# EAGLE design 4watt (EAGLE 6.5.0)

## Sheet 1 of 2
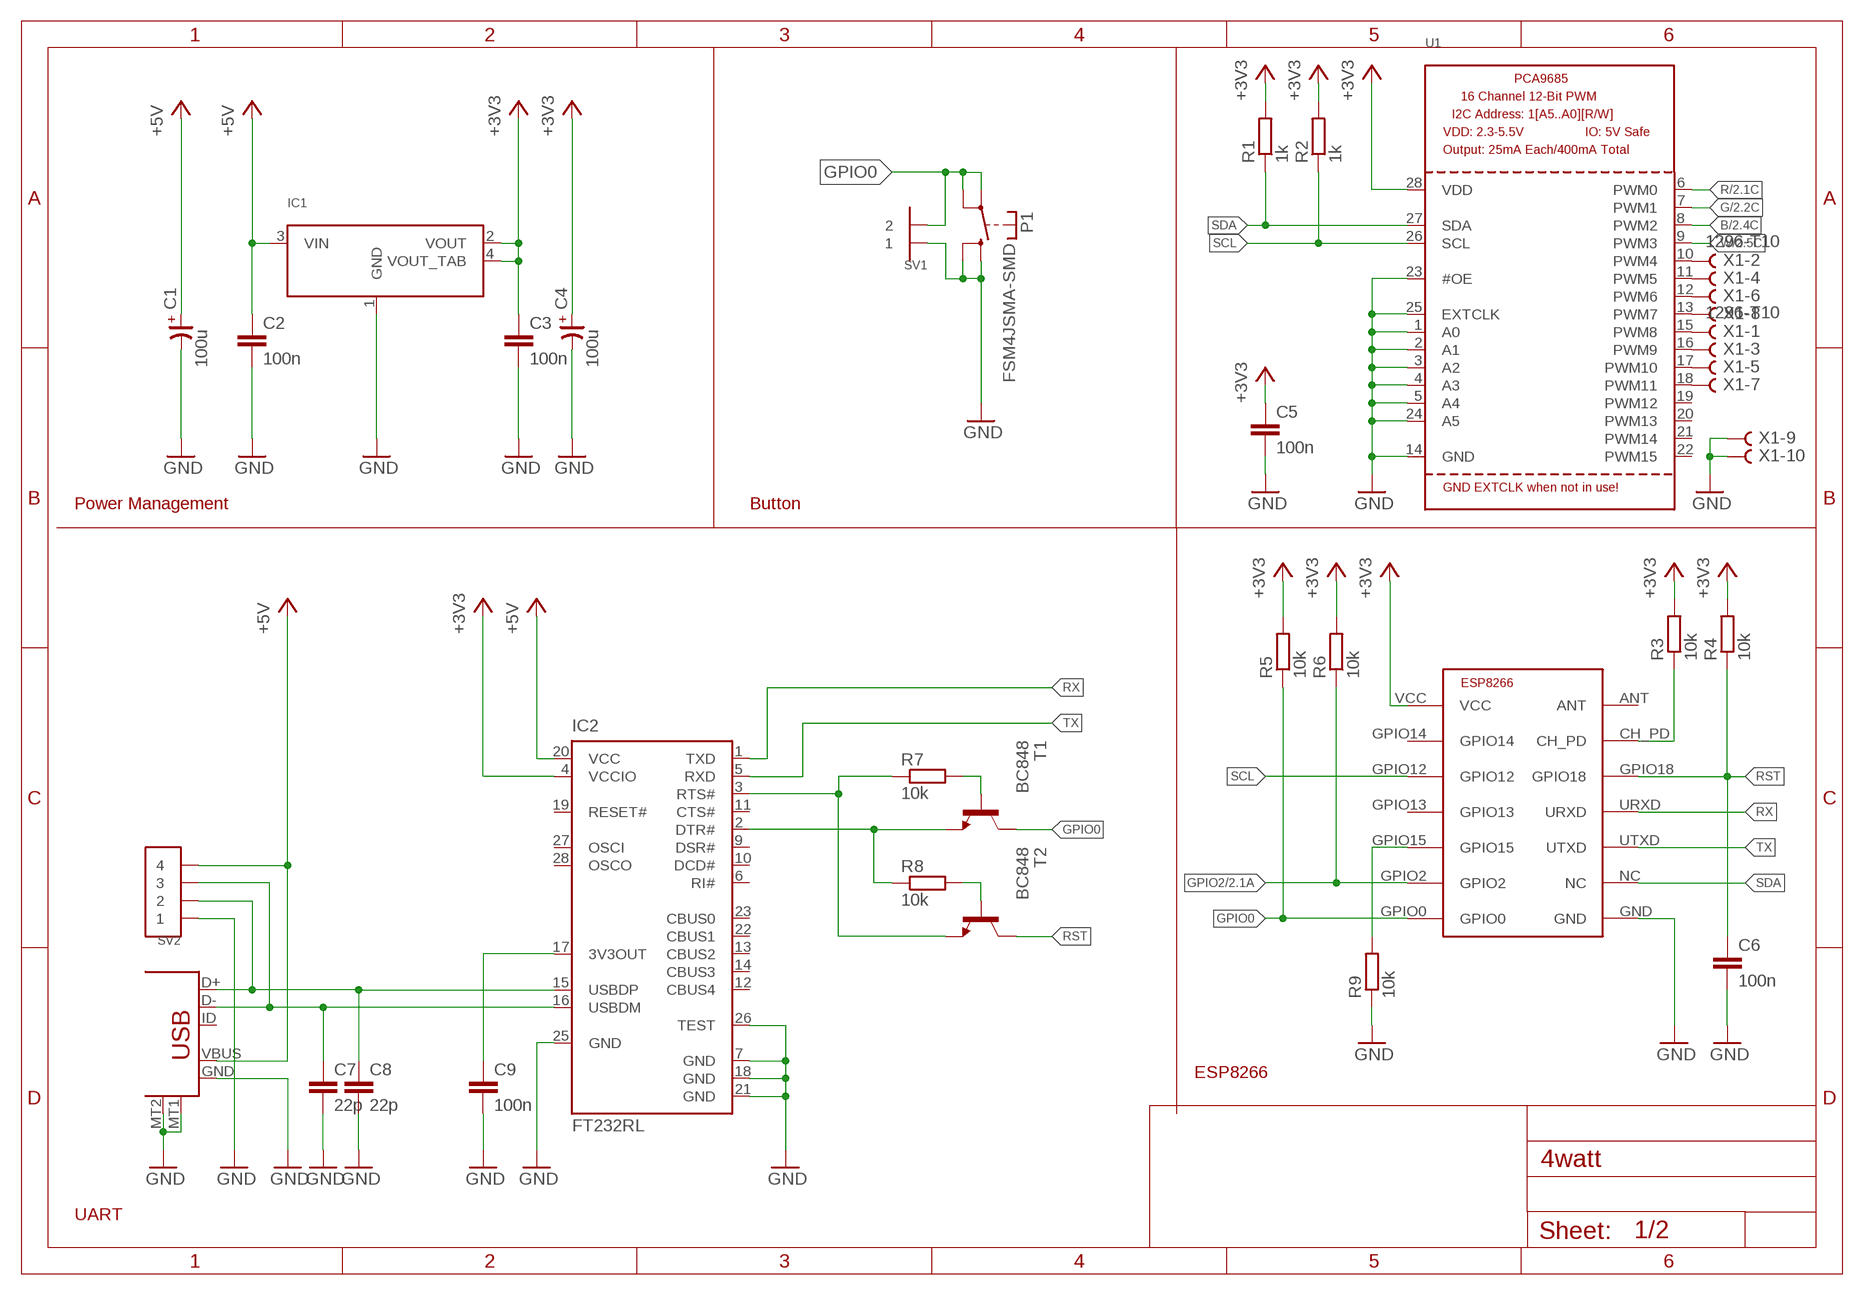
[diagram p0: schematic, sheet 1]

### Parts
C1  100u  CP-7343-TE-D  [7343-TE-D]
C2  100n  C-EUC0603  [C0603]
C3  100n  C-EUC0603  [C0603]
C4  100u  CP-7343-TE-D  [7343-TE-D]
C5  100n  C-EUC0603  [C0603]
C6  100n  C-EUC0603  [C0603]
C7  22p  C-EUC0603  [C0603]
C8  22p  C-EUC0603  [C0603]
C9  100n  C-EUC0603  [C0603]
IC1  LM1117IMP  [SOT223]
IC2  FT232RL  [SSOP28]
P1  FSM4JSMA-SMD  [FSM4JSMA-SMD]
R1  1k  R-EU_R0603  [R0603]
R2  1k  R-EU_R0603  [R0603]
R3  10k  R-EU_R0603  [R0603]
R4  10k  R-EU_R0603  [R0603]
R5  10k  R-EU_R0603  [R0603]
R6  10k  R-EU_R0603  [R0603]
R7  10k  R-EU_R0603  [R0603]
R8  10k  R-EU_R0603  [R0603]
R9  10k  R-EU_R0603  [R0603]
SV1  1X2SMD-2.54LIEGEND  [1X2SMD-2.54LIEGEND]
SV2  1X4SMD-2.54LIEGEND  [1X4SMD-2.54LIEGEND]
T1  BC848  [SOT23]
T2  BC848  [SOT23]
U1  PCA9685  [TSSOP28]
U$1  ESP8266  [ESP-03]
X1  1296-T10  [1296-10]
X2  USB-B  [USB-MICROB]

### Nets
+3V3: C3.1 C4.+ C5.1 IC1.2(VOUT) IC1.4(VOUT_TAB) IC2.4(VCCIO) R1.2 R2.2 R3.2 R4.2 R5.2 R6.2 U1.28(VDD) U$1.VCC
+5V [pwr]: C1.+ C2.1 IC1.3(VIN) IC2.20(VCC) SV2.P$4 X2.VBUS ; also sheet 2
B: U1.8(PWM2) ; also sheet 2
G: U1.7(PWM1) ; also sheet 2
GND [pwr]: C1.- C2.2 C3.2 C4.- C5.2 C6.2 C7.2 C8.2 C9.2 IC1.1(GND) IC2.7(GND) IC2.18(GND) IC2.21(GND) IC2.25(GND) IC2.26(TEST) P1.P$3(S) P1.P$4(S) R9.1 SV1.P$1 SV2.P$1 U1.1(A0) U1.2(A1) U1.3(A2) U1.4(A3) U1.5(A4) U1.14(GND) U1.23(#OE) U1.24(A5) U1.25(EXTCLK) U$1.GND X1.9 X1.10 X2.GND X2.MT1 X2.MT2 ; also sheet 2
GPIO0: P1.P$1(P) P1.P$2(P) R5.1 SV1.P$2 T1.3(C) U$1.GPIO0
GPIO2: R6.1 U$1.GPIO2 ; also sheet 2
GPIO15: R9.2 U$1.GPIO15
N$1: IC2.3(RTS#) R7.1 T2.2(E)
N$2: R3.1 U$1.CH_PD
N$3: C8.1 IC2.15(USBDP) SV2.P$2 X2.D+
N$4: C7.1 IC2.16(USBDM) SV2.P$3 X2.D-
N$5: IC2.2(DTR#) R8.1 T1.2(E)
N$7: R7.2 T1.1(B)
N$8: R8.2 T2.1(B)
N$12: C9.1 IC2.17(3V3OUT)
N$15: U1.10(PWM4) X1.2
N$16: U1.11(PWM5) X1.4
N$17: U1.12(PWM6) X1.6
N$18: U1.13(PWM7) X1.8
N$19: U1.15(PWM8) X1.1
N$20: U1.16(PWM9) X1.3
N$21: U1.17(PWM10) X1.5
N$22: U1.18(PWM11) X1.7
R: U1.6(PWM0) ; also sheet 2
RST: C6.1 R4.1 T2.3(C) U$1.GPIO18
RX: IC2.1(TXD) U$1.URXD
SCL: R2.1 U1.26(SCL) U$1.GPIO12
SDA: R1.1 U1.27(SDA) U$1.NC
TX: IC2.5(RXD) U$1.UTXD
W: U1.9(PWM3) ; also sheet 2
Unconnected: IC2.6(RI#) IC2.9(DSR#) IC2.10(DCD#) IC2.11(CTS#) IC2.12(CBUS4) IC2.13(CBUS2) IC2.14(CBUS3) IC2.19(RESET#) IC2.22(CBUS1) IC2.23(CBUS0) IC2.27(OSCI) IC2.28(OSCO) U1.19(PWM12) U1.20(PWM13) U1.21(PWM14) U1.22(PWM15) U$1.ANT U$1.GPIO13 U$1.GPIO14 X2.ID

### Notes on the sheet
- Power Management | Button
- ESP8266
- UART

## Sheet 2 of 2
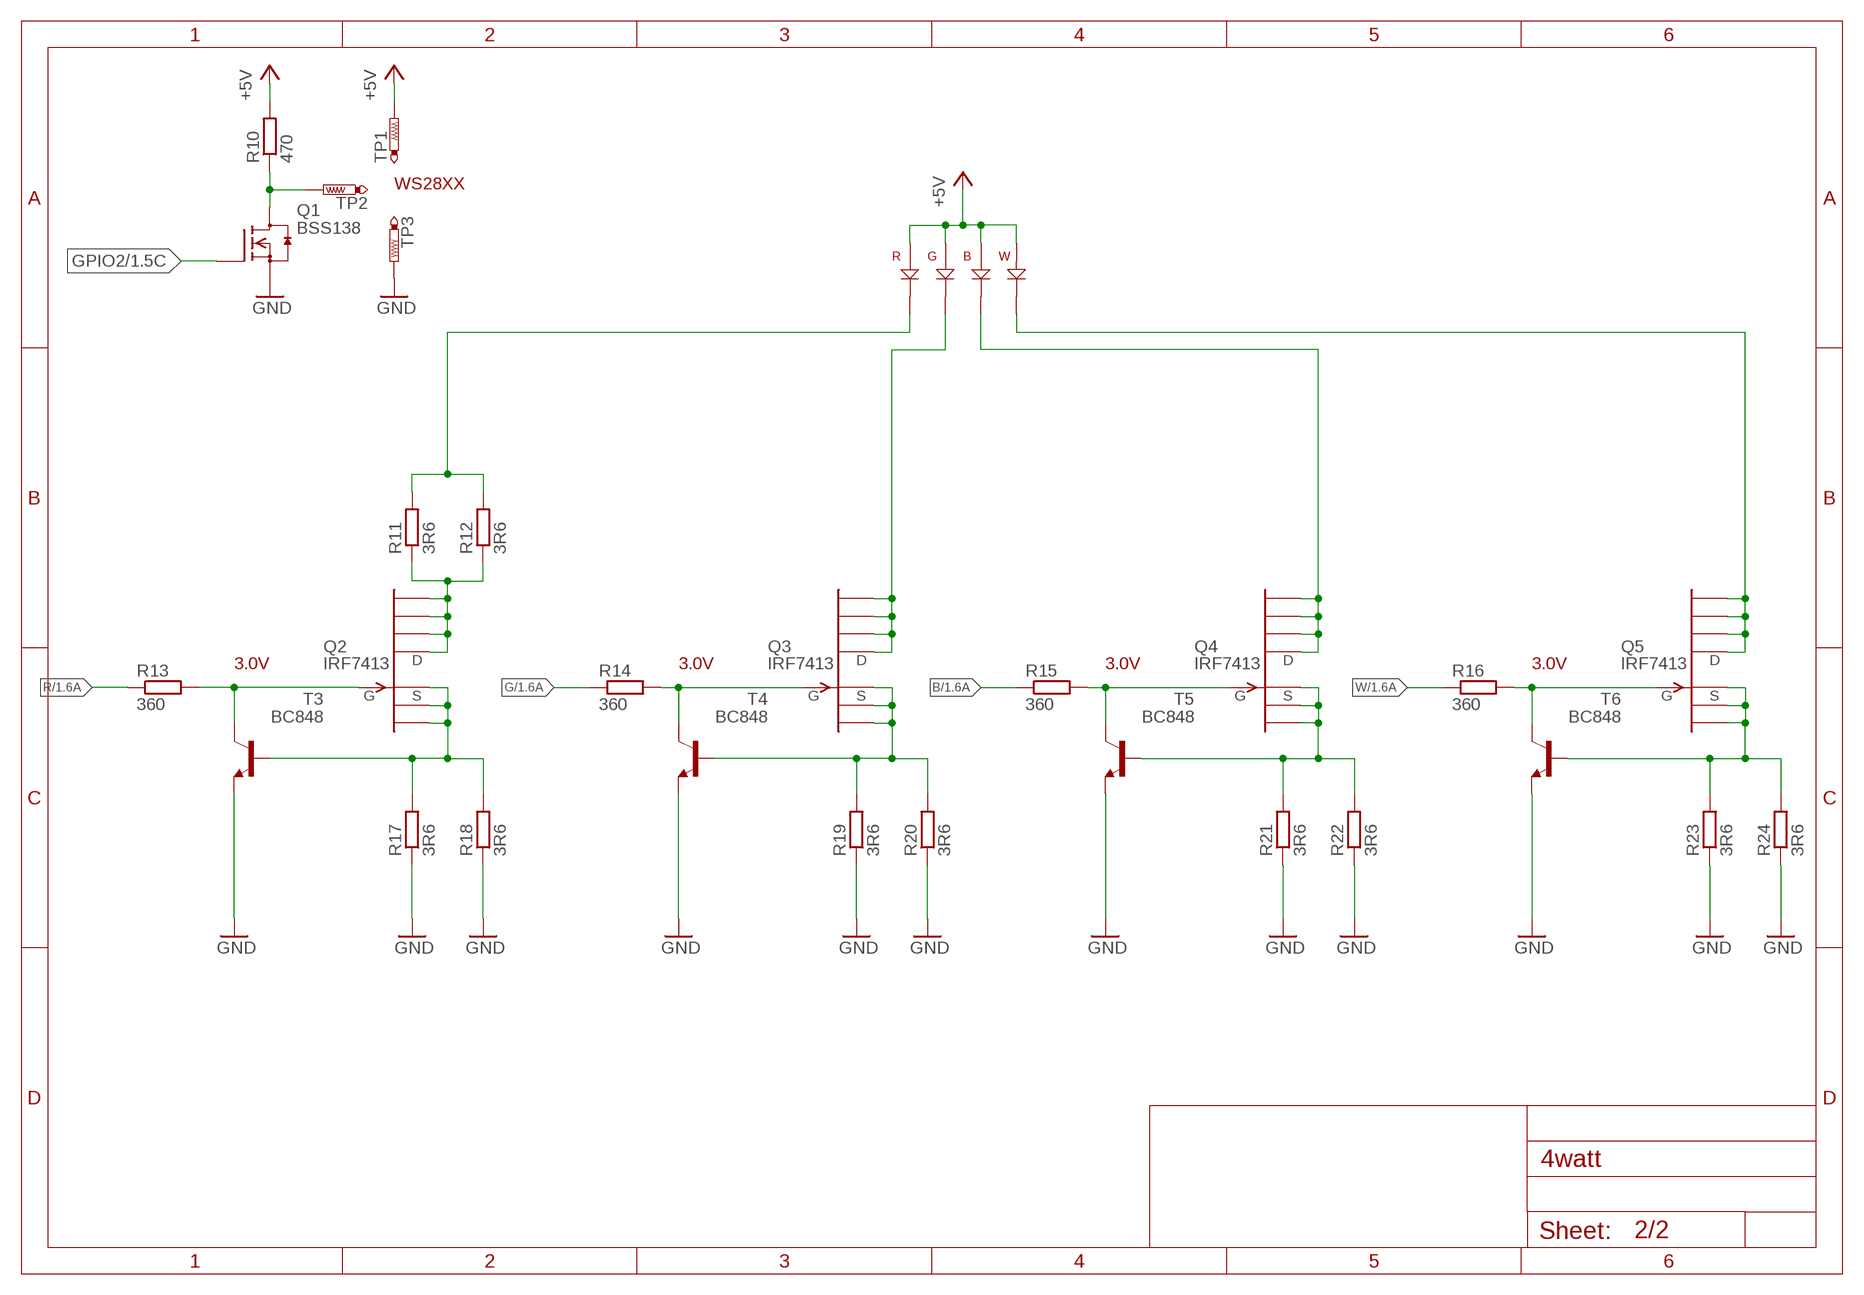
[diagram p1: schematic, sheet 2]

### Parts
LED1  JH-4RGBW14G30-E2A  [JH-4RGBW14G30-E2A]
Q1  BSS138  [SOT23]
Q2  IRF7413  [SO-8]
Q3  IRF7413  [SO-8]
Q4  IRF7413  [SO-8]
Q5  IRF7413  [SO-8]
R10  470  R-EU_R0603  [R0603]
R11  3R6  R-EU_M1206  [M1206]
R12  3R6  R-EU_M1206  [M1206]
R13  360  R-EU_R0603  [R0603]
R14  360  R-EU_R0603  [R0603]
R15  360  R-EU_R0603  [R0603]
R16  360  R-EU_R0603  [R0603]
R17  3R6  R-EU_M1206  [M1206]
R18  3R6  R-EU_M1206  [M1206]
R19  3R6  R-EU_M1206  [M1206]
R20  3R6  R-EU_M1206  [M1206]
R21  3R6  R-EU_M1206  [M1206]
R22  3R6  R-EU_M1206  [M1206]
R23  3R6  R-EU_M1206  [M1206]
R24  3R6  R-EU_M1206  [M1206]
T3  BC848  [SOT23]
T4  BC848  [SOT23]
T5  BC848  [SOT23]
T6  BC848  [SOT23]
TP1  PTR1B2,54  [B2,54]
TP2  PTR1B1,27  [B1,27]
TP3  PTR1B2,54  [B2,54]

### Nets
+5V [pwr]: LED1.B+ LED1.G+ LED1.R+ LED1.W+ R10.2 TP1.TP ; also sheet 1
B: R15.1 ; also sheet 1
G: R14.1 ; also sheet 1
GND [pwr]: Q1.2(S) R17.1 R18.1 R19.1 R20.1 R21.1 R22.1 R23.1 R24.1 T3.2(E) T4.2(E) T5.2(E) T6.2(E) TP3.TP ; also sheet 1
GPIO2: Q1.1(G) ; also sheet 1
N$6: Q1.3(D) R10.1 TP2.TP
N$9: Q2.1(S) Q2.2(S1) Q2.3(S2) R17.2 R18.2 T3.1(B)
N$10: Q2.5(D) Q2.6(D1) Q2.7(D2) Q2.8(D3) R11.1 R12.1
N$11: Q5.4(G) R16.2 T6.3(C)
N$13: Q5.1(S) Q5.2(S1) Q5.3(S2) R23.2 R24.2 T6.1(B)
N$14: LED1.W- Q5.5(D) Q5.6(D1) Q5.7(D2) Q5.8(D3)
N$24: Q2.4(G) R13.2 T3.3(C)
N$25: LED1.R- R11.2 R12.2
N$26: Q3.4(G) R14.2 T4.3(C)
N$27: Q3.1(S) Q3.2(S1) Q3.3(S2) R19.2 R20.2 T4.1(B)
N$28: LED1.G- Q3.5(D) Q3.6(D1) Q3.7(D2) Q3.8(D3)
N$29: Q4.4(G) R15.2 T5.3(C)
N$30: Q4.1(S) Q4.2(S1) Q4.3(S2) R21.2 R22.2 T5.1(B)
N$31: LED1.B- Q4.5(D) Q4.6(D1) Q4.7(D2) Q4.8(D3)
R: R13.1 ; also sheet 1
W: R16.1 ; also sheet 1

### Notes on the sheet
- WS28XX
- 3.0V | 3.0V | 3.0V | 3.0V

## Library data of the parts
C1 C4 = cap-master:CP-: POLARIZED CAP
C2 C3 C5-C9 = rcl:C-EU: CAPACITOR, European symbol
IC1 = sid:LM1117IMP
IC2 = ftdichip:FT232R: Source: http://www.ftdichip.com/Documents/DataSheets/DS_FT232R_v104.pdf
LED1 = sid:JH-4RGBW14G30-E2A
P1 = switch-misc:FSM4JSMA-SMD: TYCO SWITCH
Q1 = m-pad-2.1:BSS138: Fairchild Semiconductors BSS138 N-Channel Logic Level Enhancement Mode Field Effect Transistor General Description: These N-Channel enhancement mode field effect transistors are produced using Fairchild's proprietary, high cell density, DMOS technology. These products have been designed to minimize on-state resistance while provide rugged, reliable, and fast switching performance.These products are particularly suited for low voltage, low current applications such as small servo motor control, power MOSFET gate drivers, and other switching applications. Features: 0.22 A, 50 V. RDS(ON) = 3.5Ohm @ VGS = 10 V RDS(ON) = 6.0Ohm @ VGS = 4.5 V High density cell design for extremely low RDS(ON) Rugged and Reliable Compact industry standard SOT-23 surface mount package Please send any comments to: messi@users.sourceforge.net
Q2-Q5 = transistor-fet:IRF7413
R1-R24 = rcl-2:R-EU_: RESISTOR, European symbol
SV1 = sid:1X2SMD-2.54LIEGEND
SV2 = sid:1X4SMD-2.54LIEGEND
T1 T2 = transistor-neu-to92:BC848: NPN TRANSISTOR
T3-T6 = transistor:BC848: NPN TRANSISTOR
TP1-TP3 = testpad:PTR1: TEST PIN
U1 = adafruit:PCA9685: PCA9685 - 16 Channel 12-Bit I2C PWM Controller 5.0V tolerant 16 channel, 12-bit I2C PWM controller with 25mA per output (max. 400mA total) Digikey: 568-5931-1-ND
U$1 = ESP8266:ESP8266: low cost Wifi to Serial Module
X1 = con-leotronics:1296-T10: 1.27mm SINGLE ROW FEMALE SOCKET Source: http://www.leotronics.co.uk/Conexcon/Data%20Sheets/sec.%20A/1296ing.pdf
X2 = sid:USB-B

## Net classes
0 default: width 0.152 mm, drill 0.305 mm, clearance 0.152 mm
1 pwr: width 0.152 mm, drill 0.305 mm, clearance 0.152 mm

## Board
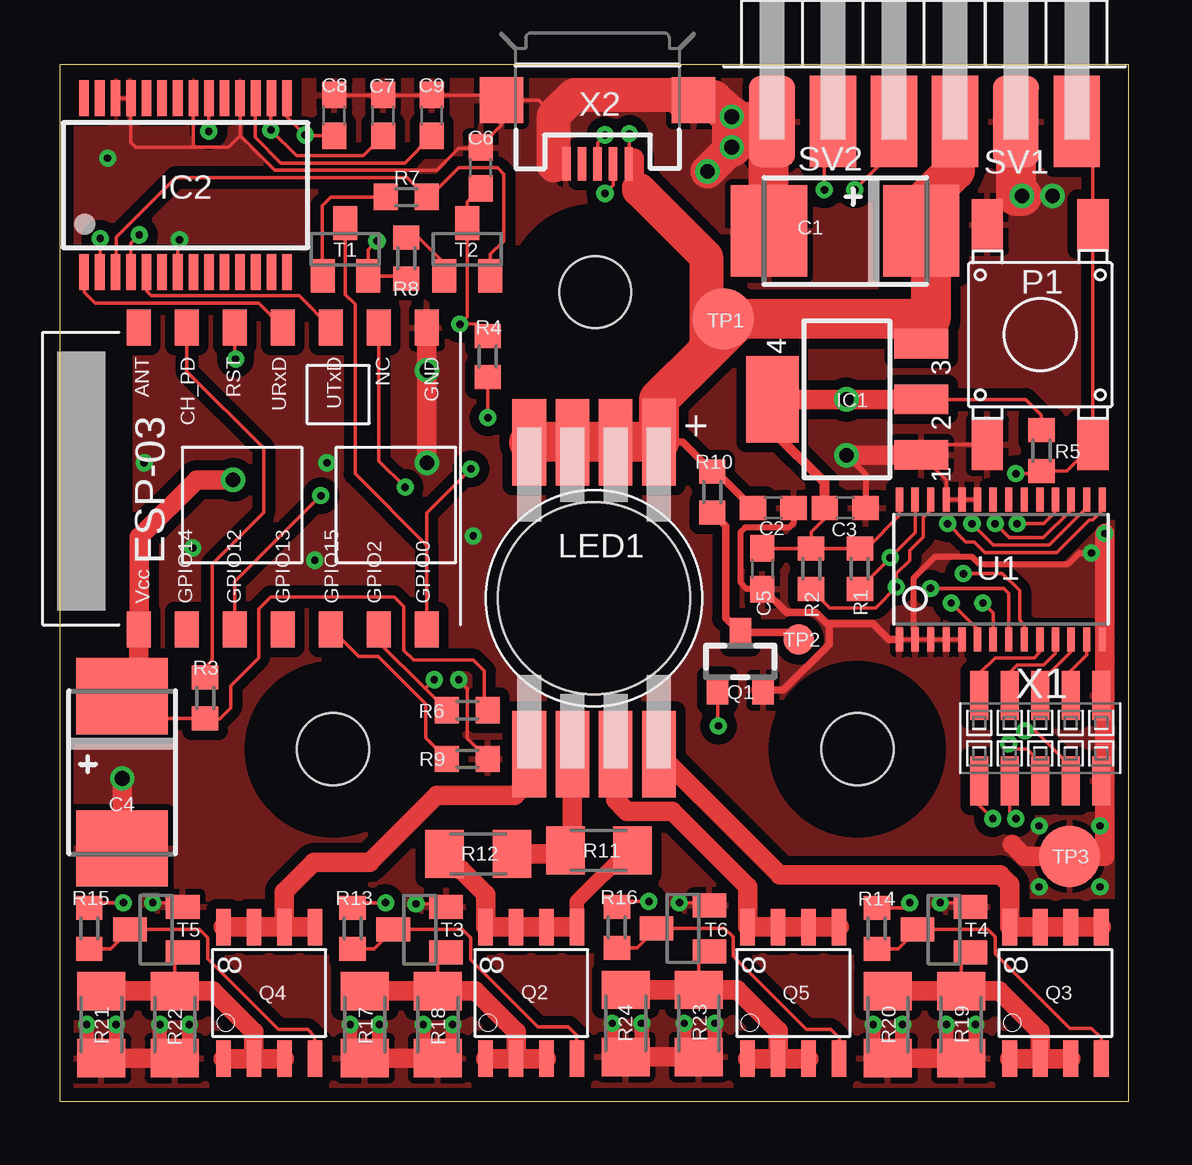
[diagram p2: board, top side]
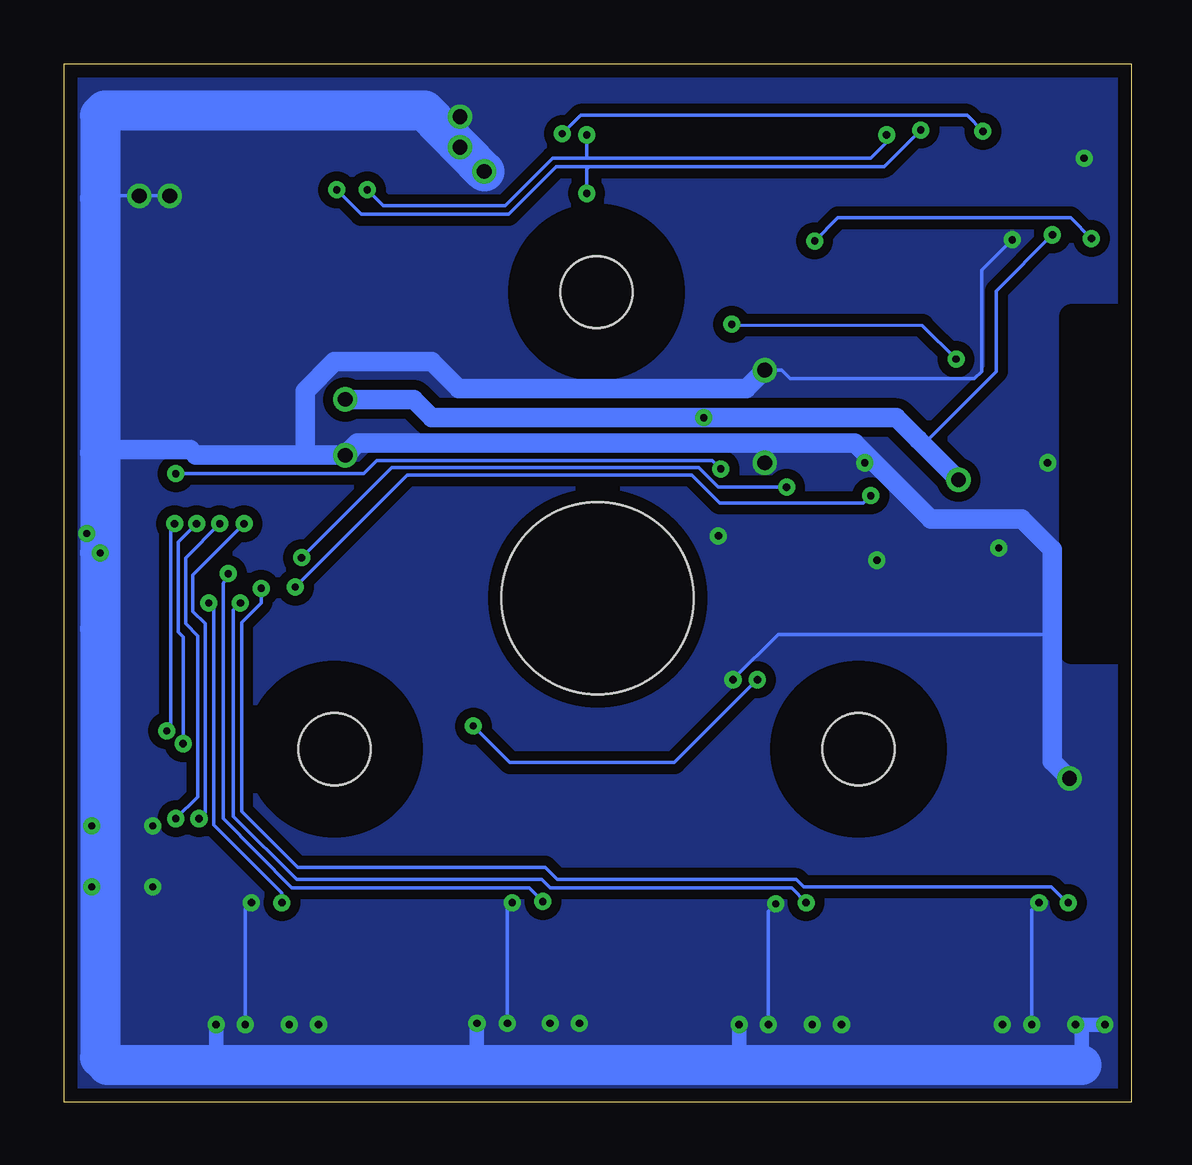
[diagram p3: board, bottom side, seen from below]

Size 44.5 x 43.24 mm. Coordinates in mm from the lower left corner, seen from the top.
Outline: 44.5,43.24 44.5,0 0,0 0,43.24 44.5,43.24
Copper layers (1*16): Top 0.035mm / dielectric 1.5mm / Bottom 0.035mm
Design rules "default *": minimum track width 6mil, minimum drill 12mil, track to track 6mil, track to pad 6mil, pad to pad 6mil, via to via 6mil, smd to smd 6mil, copper to edge 22mil, drill to drill 8mil, minimum pad ring 10mil, minimum via ring 8mil, stop-mask expansion 4mil, vias tented up to drill 26mil, thermal gap 10mil
Holes 3 mm at 22.3,33.74 11.38,14.69 33.22,14.69
tRestrict: area 19.1,30.5 to 25.5,36.9; area 8.2,11.5 to 14.6,17.9; area 30,11.5 to 36.4,17.9; 3 lines
bRestrict: area 30,11.5 to 36.4,17.9; area 8.2,11.5 to 14.6,17.9; area 19.1,30.5 to 25.5,36.9; 3 lines

### Footprints (pad centres in the part's own frame; a part is rotated, then mirrored left to right if it is on the bottom)
7343-TE-D = smd 3.175 x 3.81: + 3.175,0; - -3.175,0
C0603 = smd 1.1 x 1: 1 -0.85,0; 2 0.85,0
SOT223 = smd 1.219 x 2.235: 1 -2.311,-3.099; 2 0,-3.099; 3 2.311,-3.099 | smd 3.6 x 2.2: 4 0,3.099
SSOP28 = smd 0.4 x 1.5: 1 -4.225,-3.625; 2 -3.575,-3.625; 3 -2.925,-3.625; 4 -2.275,-3.625; 5 -1.625,-3.625; 6 -0.975,-3.625; 7 -0.325,-3.625; 8 0.325,-3.625; 9 0.975,-3.625; 10 1.625,-3.625; 11 2.275,-3.625; 12 2.925,-3.625; 13 3.575,-3.625; 14 4.225,-3.625; 15 4.225,3.625; 16 3.575,3.625; 17 2.925,3.625; 18 2.275,3.625; 19 1.625,3.625; 20 0.975,3.625; 21 0.325,3.625; 22 -0.325,3.625; 23 -0.975,3.625; 24 -1.625,3.625; 25 -2.275,3.625; 26 -2.925,3.625; 27 -3.575,3.625; 28 -4.225,3.625
JH-4RGBW14G30-E2A = smd 3.6 x 1.4: B+ -6.5,-2.7; B- 6.5,-2.7; G+ -6.5,2.7; G- 6.5,2.7; R+ -6.5,-0.9; R- 6.5,-0.9; W+ -6.5,0.9; W- 6.5,0.9 | hole 8: 0,0
FSM4JSMA-SMD = smd 1.3 x 2.1: P$1 -2.196,4.584; P$2 -2.196,-4.6; P$3 2.204,4.584; P$4 2.204,-4.6
SOT23 = smd 0.9 x 1.2: 1 -0.95,-1.2; 2 0.95,-1.2; 3 0,1.2
SO-8 = smd 1.524 x 0.61: 1 -2.743,1.27; 2 -2.743,0; 3 -2.743,-1.27; 4 -2.743,-2.54; 5 2.743,-2.54; 6 2.743,-1.27; 7 2.743,0; 8 2.743,1.27
R0603 = smd 1 x 1.1: 1 -0.85,0; 2 0.85,0
M1206 = smd 1.6 x 2: 1 -1.4,0; 2 1.4,0
1X2SMD-2.54LIEGEND = smd 1.93 x 3.81: P$1 -1.27,-0.254; P$2 1.27,-0.254
1X4SMD-2.54LIEGEND = smd 1.93 x 3.81: P$1 -5.08,0; P$2 -2.54,0; P$3 0,0; P$4 2.54,0
SOT23' = smd 1 x 1.4: 1 -0.95,-1.1; 2 0.95,-1.1; 3 0,1.1
B2,54 = smd 2.54 x 2.54: TP 0,0
B1,27 = smd 1.27 x 1.27: TP 0,0
TSSOP28 = smd 0.305 x 0.991: 1 -4.225,-2.918; 2 -3.575,-2.918; 3 -2.925,-2.918; 4 -2.275,-2.918; 5 -1.625,-2.918; 6 -0.975,-2.918; 7 -0.325,-2.918; 8 0.325,-2.918; 9 0.975,-2.918; 10 1.625,-2.918; 11 2.275,-2.918; 12 2.925,-2.918; 13 3.575,-2.918; 14 4.225,-2.918; 15 4.225,2.918; 16 3.575,2.918; 17 2.925,2.918; 18 2.275,2.918; 19 1.625,2.918; 20 0.975,2.918; 21 0.325,2.918; 22 -0.325,2.918; 23 -0.975,2.918; 24 -1.625,2.918; 25 -2.275,2.918; 26 -2.925,2.918; 27 -3.575,2.918; 28 -4.225,2.918
ESP-03 = smd 1 x 1.5: ANT 4,12.4; CH_PD 6,12.4; GND 16,12.4; GPIO0 16,-0.2; GPIO2 14,-0.2; GPIO12 8,-0.2; GPIO13 10,-0.2; GPIO14 6,-0.2; GPIO15 12,-0.2; GPIO18 8,12.4; NC 14,12.4; URXD 10,12.4; UTXD 12,12.4; VCC 4,-0.2
1296-10 = smd 0.76 x 2.05: 1 -2.54,-1.78; 2 -2.54,1.78; 3 -1.27,-1.78; 4 -1.27,1.78; 5 0,-1.78; 6 0,1.78; 7 1.27,-1.78; 8 1.27,1.78; 9 2.54,-1.78; 10 2.54,1.78
USB-MICROB = smd 0.35 x 1.4: D+ 0,2.65; D- -0.65,2.65; GND 1.3,2.65; ID 0.65,2.65; VBUS -1.3,2.65 | smd 1.8 x 1.9: MT1 -4,0; MT2 4,0

### Placement (x,y rotation side)
C1  32.72,36.29 0 top
C2  29.72,24.75 0 top
C3  32.72,24.75 0 top
C4  2.59,13.72 90 top
C5  29.26,22.21 270 top
C6  17.53,38.92 90 top
C7  13.46,41.11 90 top
C8  11.43,41.11 90 top
C9  15.49,41.11 90 top
IC1  32.79,29.27 90 top
IC2  5.23,38.2 0 top
LED1  22.25,20.99 270 top
P1  40.84,31.96 180 top
Q1  28.35,18.35 0 top
Q2  19,4.53 90 top
Q3  40.84,4.53 90 top
Q4  8.08,4.53 90 top
Q5  29.92,4.53 90 top
R1  33.33,22.21 90 top
R2  31.29,22.21 90 top
R3  6.05,16.82 270 top
R4  17.82,31.05 270 top
R5  40.89,27.14 90 top
R6  16.97,16.32 0 top
R7  14.43,37.7 180 top
R8  14.43,35.16 90 top
R9  16.97,14.28 180 top
R10  27.18,25.41 90 top
R11  22.45,10.47 180 top
R12  17.43,10.32 0 top
R13  12.19,7.22 270 top
R14  34.04,7.22 270 top
R15  1.22,7.22 270 top
R16  23.2,7.26 270 top
R17  12.7,3.21 90 top
R18  15.75,3.21 90 top
R19  37.54,3.21 90 top
R20  34.49,3.21 90 top
R21  1.73,3.21 90 top
R22  4.78,3.21 90 top
R23  26.62,3.26 90 top
R24  23.57,3.26 90 top
SV1  41.1,41.11 0 top
SV2  34.75,40.85 0 top
T1  BC848  [SOT23']  11.89,35.52 0 top
T2  BC848  [SOT23']  16.97,35.52 0 top
T3  BC848  [SOT23']  14.99,7.17 90 top
T4  BC848  [SOT23']  36.83,7.17 90 top
T5  BC848  [SOT23']  4.01,7.17 90 top
T6  BC848  [SOT23']  25.96,7.22 90 top
TP1  27.64,32.62 0 top
TP2  30.79,19.26 0 top
TP3  42.06,10.22 0 top
U1  39.2,22.18 0 top
U$1  -0.71,19.87 0 top
X1  40.84,15.15 0 top
X2  22.4,41.74 180 top

### Tracks (layer width: path | path; a pad name or v marks a point on that pad's centre or on a via)
+3V3  (via drill 0.3, 0.61)
  Top 0.152: IC2.4 2.96,35.78 v3.3,36.13 | U1.28 34.98,24.42 33.68,23.12 33.44,23.11 R1.2 R2.2 | R2.2 C5.1 | C3.1 31.85,24.29 31.29,23.73 R2.2 | IC1.2 40.23,29.27 40.9,28.61 R5.2 | 3.29,17.6 3.29,15.97 R3.2 6.06,15.96 6.66,15.96 7.11,16.42 7.11,17.33 8.28,18.5 8.28,20.53 8.79,21.04 13.92,21.04 14.33,20.63 14.33,18.8 14.73,18.4 17.22,18.4 17.68,17.94 17.68,16.45 R6.2 | 18.04,29.79 R4.2 17.83,29.79 v17.83,28.51
  Top 0.406: IC1.4 29.69,27.98 31.85,25.81 31.85,24.71 C3.1
  Top 0.813: IC1.2 v32.77,29.27 IC1.4 | v7.21,25.92 5.69,25.92 3.3,23.53 3.3,19.74 U$1.VCC 3.29,17.6 C4.+
  Bottom 0.152: v3.3,36.13 5.64,33.79 5.64,30.44 8.48,27.59 8.89,27.59
  Bottom 0.813: v7.21,25.92 8.89,27.59 9.8,28.51 v17.83,28.51 29.16,28.51 29.92,29.27 v32.77,29.27
+5V  (via drill 0.3)
  Top 0.152: IC2.20 v6.21,40.45 v6.2,40.45 | v23.72,40.34 23.72,39.12 X2.VBUS
  Top 0.254: X2.VBUS 23.7,38.31 23.93,39.33
  Top 0.305: LED1.G+ 25.95,27.49 R10.2 27.41,26.21 C2.1
  Top 0.406: 26.92,31.25 26.92,30.59 TP1.TP
  Top 0.813: 23.93,39.33 23.93,38.11
  Top 1.016: 36.27,32.62 35.88,32.24 IC1.3 | 23.93,38.11 24.13,38.01
  Top 1.422: C1.+ 36.01,36.18 36.27,36.18 | 24.13,38.01 26.92,35.21 26.92,31.25
  Top 1.676: 36.27,36.18 36.27,32.62 28.3,32.62 26.92,31.25 24.95,29.28 LED1.G+ LED1.W+ LED1.R+ LED1.B+ | SV2.P$4 37.29,38.82 35.89,37.42 C1.+
  Bottom 0.152: v23.72,40.34 22.96,41.11 6.86,41.11 v6.2,40.45
B  (via drill 0.3)
  Top 0.152: R15.1 1.44,8.29 v2.64,8.29 | v36.27,21.4 39.32,21.4 39.53,21.19 U1.8
  Bottom 0.152: v2.64,8.29 2.69,8.29 3.35,8.95 13.67,8.95 13.97,9.25 23.93,9.25 24.44,9.76 34.75,9.76 37.09,12.1 37.09,19.97 36.27,20.79 v36.27,21.4
G  (via drill 0.3)
  Top 0.152: R14.1 35.19,8.07 v35.41,8.29 | v38.46,20.79 38.88,20.36 U1.7
  Bottom 0.152: v35.41,8.29 35.41,8.7 38.25,11.54 38.25,20.58 v38.46,20.79
GND  (via drill 0.3, 0.61)
  Top 0.152: T5.2 4.95,8.29 v3.86,8.29 | T3.2 15.97,8.24 v14.83,8.24 | T6.2 26.94,8.29 v25.81,8.29 | T4.2 37.76,8.29 v36.68,8.29 | C8.2 C7.2 C9.2 18.18,41.96 X2.MT2 | X2.MT2 19.94,41.74 20.58,41.11 | IC2.18 7.51,40.26 | 7.51,40.26 8.94,38.82 15.7,38.82 16.61,39.73 17.49,39.73 C6.2 17.53,39.84 18.39,40.7 X2.MT2 | IC2.26 IC2.25 2.96,39.98 3.15,39.78 5.49,39.78 | 5.49,39.78 7.04,39.78 7.51,40.26 | IC2.21 5.56,39.85 5.49,39.78 | IC2.7 4.91,35.85 v4.98,35.92 | U1.23 U1.24 U1.25 36.93,25.92 IC1.1 36.3,27.38 P1.P$3 | U1.1 U1.2 | U1.2 U1.3 U1.4 U1.5 | 29.26,21.4 C5.2 28.94,21.41 | 39.83,37.76 P1.P$4 | R9.1 16.97,15.13 16.97,17.23 v16.61,17.59 | v42.98,22.87 43.03,22.87 43.23,22.87 43.44,22.67 43.44,19.37 U1.14 | 35.56,19.67 U1.2
  Top 0.254: X2.GND 21.08,39.07 20.58,39.02 | v32.77,26.93 33.57,26.13 C3.2 | C2.2 30.57,24.12 30.38,23.94 28.55,23.94 28.35,23.73 28.35,21.65 28.6,21.4 29.22,21.4 C5.2 | 35.56,19.67 35.56,21.8 36.48,22.72 38,22.72 38.3,22.41 42.01,22.41 42.47,22.87 43.03,22.87
  Top 0.305: 29.26,21.4 30.28,20.38 31.5,20.38 31.95,19.92 32.06,19.92 | 32.06,19.92 33.87,19.92 33.94,19.87 34.54,19.27 U1.1 | Q1.2 30.14,17.15 32.06,19.06 32.06,19.92
  Top 0.61: v2.34,3.21 2.34,1.81 R21.1 1.12,1.81 v1.12,3.21 | v4.17,3.21 4.17,1.81 R22.1 5.39,1.81 v5.39,3.21 | v13.31,3.21 13.31,1.81 R17.1 12.09,1.81 v12.09,3.21 | v15.14,3.21 15.14,1.81 R18.1 16.36,1.81 v16.36,3.21 | v23.01,3.26 23.01,1.86 R24.1 24.23,1.86 v24.23,3.26 | v26.01,3.26 26.01,1.86 26.11,1.86 | v27.28,3.26 27.28,1.86 R23.1 | v33.88,3.21 33.88,1.81 R20.1 35.1,1.81 v35.1,3.21 | v36.93,3.21 36.93,1.81 R19.1 38.15,1.81 v38.15,3.21
  Top 0.813: R21.1 R22.1 | R17.1 R18.1 | R24.1 26.11,1.86 R23.1 | R20.1 R19.1 | C4.- v2.59,13.47 | v32.77,26.93 32.79,26.96 IC1.1 | U$1.GND v15.29,30.49 v15.29,26.63 | v43.54,23.68 43.54,10.22 40.18,10.22 39.68,10.73
  Top 1.422: v27.99,39.78 v26.98,38.77 | 20.58,39.02 20.58,41.11 21.44,41.97 25.66,41.97 25.88,41.74 X2.MT1
  Top 1.676: v27.99,41.05 v27.99,39.78 | v27.99,41.05 28.08,40.87 SV2.P$1 29.54,40.74 C1.- | X2.MT1 27.2,41.74 v27.99,41.05 | SV1.P$1 39.83,37.76 v40.08,37.75
  Bottom 0.152: v3.86,8.29 4.17,7.98 v4.17,3.21 | v14.83,8.24 15.14,7.93 v15.14,3.21 | v25.81,8.29 26.01,8.09 v26.01,3.26 | v36.68,8.29 36.93,8.04 v36.93,3.21 | 42.62,20.08 42.98,19.72 | v40.08,37.75 v41.35,37.75 42.88,37.75 42.98,37.65 | v15.29,30.49 14.58,30.49 14.23,30.13 6.55,30.13 6.25,30.44 6.25,34.65 v4.98,35.92 | v16.61,17.59 14.73,19.46 3.3,19.46
  Bottom 0.61: 2.08,1.53 2.08,3.21 v1.12,3.21 | v27.28,3.26 27.28,1.53 27.23,1.53 | 42.67,1.53 38.15,1.53 v38.15,3.21 | v16.36,3.21 16.36,1.53 17.27,1.53
  Bottom 0.813: v2.59,13.47 3.3,14.18 3.3,19.46 3.3,23.02 4.57,24.29 8.38,24.29 11.53,27.44 32.26,27.44 v32.77,26.93 | v15.29,30.49 16.05,29.73 28.04,29.73 29.16,30.84 33.22,30.84 34.44,29.62 34.44,26.96 | 34.44,26.96 32.79,26.96 v32.77,26.93 | 32.51,27.19 v32.77,26.93 | 34.44,26.96 38.99,26.96 39.22,27.19 42.37,27.19 42.57,26.98 42.9,26.96 42.98,27.03
  Bottom 1.676: v26.98,38.77 29.47,41.31 42.77,41.31 42.98,41.11 42.98,37.65 42.98,27.03 v42.98,22.87 42.98,19.72 42.98,1.84 42.67,1.53 27.23,1.53 17.27,1.53 2.08,1.53
  other vias: 1.98,39.33 17.22,23.58 3.51,26.63 11.13,26.63 5.54,23.07 10.62,22.56 40.79,11.49 40.79,8.95 43.33,8.95 43.33,11.49
  pour Bottom (isolate 0.406): 0.46,42.88 0.46,0.21 44.15,0.21 44.15,42.88
  pour Top (isolate 0.406): 0.46,42.88 0.46,0.21 44.15,0.21 44.15,42.88
GPIO0  (via drill 0.3)
  Top 0.152: T1.3 11.89,33.64 12.29,33.23 12.29,26.17 15.29,23.17 U$1.GPIO0 15.29,24.54 v17.12,26.37 | v39.83,26.17 40.73,26.17 R5.1 41.95,26.29 P1.P$1 P1.P$2 43.04,40.18 SV1.P$2
  Bottom 0.152: v17.12,26.37 17.48,26.73 31.45,26.73 32.01,26.17 v39.83,26.17
GPIO2  (via drill 0.3)
  Top 0.152: U$1.GPIO2 13.29,19.14 15.22,17.21 | 15.22,17.21 R6.1 | Q1.1 27.4,15.69 v27.43,15.66 | v15.6,17.59 15.22,17.21
  Bottom 0.152: v27.43,15.66 25.91,14.13 19.05,14.13 v15.6,17.59
GPIO15
  Top 0.152: U$1.GPIO15 11.33,19.67 12.45,18.55 13.26,18.55 15.24,16.57 15.24,15.16 R9.2
N$1
  Top 0.152: IC2.3 2.34,34.61 2.34,36.03 4.83,38.52 14.46,38.52 R7.1 15.39,37.7 16.61,38.92 18.24,38.92 18.49,38.67 18.49,35.87 17.93,35.31 17.93,34.43 T2.2
N$2
  Top 0.152: U$1.CH_PD 5.29,30.43 8.48,27.24 8.48,24.55 6.35,22.41 6.35,18.4 6.05,18.09 R3.1
N$3  (via drill 0.3)
  Top 0.152: SV2.P$2 31.85,40.51 v31.85,38.01 | X2.D+ 22.4,39.98 v22.71,40.29 | IC2.15 9.46,41.05 v10.21,40.29 10.25,40.26 C8.1
  Bottom 0.152: v31.85,38.01 31.19,37.35 26.11,37.35 24.13,39.33 22.71,39.33 | 22.71,39.33 10.87,39.33 10.21,39.99 v10.21,40.29 | v22.71,40.29 22.71,39.33
N$4  (via drill 0.3)
  Top 0.152: SV2.P$3 34.75,39.63 v33.12,38.01 | X2.D- 23.05,38.19 v22.71,37.85 | IC2.16 8.79,41.81 v8.79,40.5 9.86,39.43 12.64,39.43 C7.1
  Bottom 0.152: v33.12,38.01 32.11,36.99 25.96,36.99 23.98,38.97 22.61,38.97 | 22.61,38.97 10.31,38.97 v8.79,40.5 | v22.71,37.85 22.71,38.87 22.61,38.97
N$5  (via drill 0.3)
  Top 0.152: R8.1 14.42,34.42 T1.2 12.84,35.5 v13.21,35.87 | v1.68,35.98 1.68,34.59 IC2.2
  Bottom 0.152: v13.21,35.87 12.24,36.84 2.54,36.84 v1.68,35.98
N$6
  Top 0.305: R10.1 27.74,24 27.74,20.16 Q1.3 30.5,19.55 TP2.TP
N$7
  Top 0.152: R7.2 11.28,37.7 10.92,37.35 10.92,34.43 T1.1
N$8
  Top 0.152: R8.2 14.85,36.11 16,34.96 16,34.43 T2.1
N$9
  Top 0.152: T3.1 15.75,5.88 R18.2
  Top 0.813: R17.2 R18.2 17.3,4.61 19,2.9 Q2.2 | Q2.2 Q2.1 | Q2.2 Q2.3
N$10
  Top 0.61: 21.54,7.43 Q2.5 | 21.44,7.27 Q2.5 | R11.1 23.67,10.47 21.54,8.34 Q2.5
  Top 0.813: 21.44,7.27 Q2.6 Q2.7 Q2.8 17.73,8.64 16.71,9.66 16.69,9.66 R12.1
N$11
  Top 0.152: R16.2 24.05,6.41 T6.3 27.69,7.22 28.04,6.87 28.04,6.05 31.09,3.01 32.11,3.01 32.46,2.65 Q5.4
N$12
  Top 0.152: C9.1 14.36,39.12 9.2,39.12 8.13,40.19 8.13,41.8 IC2.17
N$13
  Top 0.152: T6.1 26.62,5.83 R23.2
  Top 0.813: R24.2 R23.2 28.22,4.66 29.92,2.95 Q5.2 | Q5.2 Q5.3 | Q5.2 Q5.1
N$14
  Top 0.813: LED1.W- 23.15,12.57 23.62,12.1 25.5,12.1 28.65,8.95 Q5.8 Q5.7 Q5.6 | 30.94,7.27 Q5.6 | Q5.6 Q5.5
N$15
  Top 0.152: U1.10 40.83,18.74 40.59,18.5 38.96,18.5 38.3,17.84 X1.2
N$16
  Top 0.152: U1.11 41.48,18.68 41,18.2 39.88,18.2 39.57,17.89 X1.4
N$17
  Top 0.152: U1.12 42.13,18.77 41.25,17.89 41,17.89 40.84,17.74 X1.6
N$18
  Top 0.152: U1.13 42.78,18.61 42.11,17.94 X1.8
N$19  (via drill 0.3)
  Top 0.152: X1.1 38.3,12.35 v38.86,11.79 | U1.15 43.38,24.6 43.03,24.24 42.88,24.24 41.53,22.89 38.53,22.89 38.1,23.33 37.74,23.33 v36.98,24.09
  Bottom 0.152: v38.86,11.79 38.61,12.05 38.61,19.92 39.12,20.43 39.12,21.95 v36.98,24.09
N$20  (via drill 0.3)
  Top 0.152: X1.3 39.57,12.05 v39.83,11.79 | v38,24.09 38.89,23.2 41.23,23.2 42.78,24.75 U1.16
  Bottom 0.152: v39.83,11.79 38.91,12.71 38.91,19.41 39.42,19.92 39.42,22.67 v38,24.09
N$21  (via drill 0.3)
  Top 0.152: X1.5 40.84,14.13 40.28,14.69 39.75,14.69 v39.52,14.92 | v38.96,24.09 39.55,23.5 40.97,23.5 42.06,24.6 42.06,25.03 U1.17
  Bottom 0.152: v39.52,14.92 39.52,19.36 39.73,19.57 39.73,23.33 v38.96,24.09
N$22  (via drill 0.3)
  Top 0.152: X1.7 42.11,13.98 40.64,15.45 v40.21,15.45 | v39.88,24.09 41,24.09 41.45,24.55 41.45,25.08 U1.18
  Bottom 0.152: v40.21,15.45 40.03,15.6 40.03,23.94 v39.88,24.09
N$24
  Top 0.152: R13.2 13.09,6.37 T3.3 16.77,7.17 17.12,6.82 17.12,5.9 19.91,3.11 21.18,3.11 21.54,2.75 Q2.4
N$25
  Top 0.813: LED1.R- 21.35,11.15 20.52,10.32 | R12.2 20.52,10.32 | 20.52,10.32 R11.2
N$26
  Top 0.152: R14.2 34.93,6.37 T4.3 38.66,7.17 38.96,6.87 38.96,6.16 42.06,3.06 42.98,3.06 43.38,2.65 Q3.4
N$27
  Top 0.152: T4.1 37.54,5.83 R19.2
  Top 0.813: R20.2 R19.2 39.14,4.61 40.84,2.9 Q3.2 | Q3.2 Q3.1 | Q3.3 Q3.2
N$28
  Top 0.813: Q3.5 Q3.6 Q3.7 Q3.8 39.57,9.05 39.17,9.46 29.98,9.46 LED1.G-
N$29
  Top 0.152: R15.2 2.12,6.37 T5.3 5.79,7.17 6.15,6.82 6.15,5.95 9.09,3.01 10.31,3.01 10.62,2.7 Q4.4
N$30
  Top 0.152: T5.1 4.78,5.88 R22.2
  Top 0.813: R21.2 R22.2 6.37,4.61 8.08,2.9 Q4.2 | Q4.1 Q4.2 | Q4.2 Q4.3
N$31
  Top 0.406: 10.52,7.27 Q4.5
  Top 0.813: Q4.6 9.35,8.75 10.57,9.97 12.9,9.97 15.7,12.76 18.95,12.76 19.55,13.36 LED1.B- | Q4.6 10.52,7.27 | Q4.6 Q4.7 Q4.8
R  (via drill 0.3)
  Top 0.152: R13.1 12.41,8.29 v13.56,8.29 | v37.14,20.79 38.23,19.69 U1.6
  Bottom 0.152: v13.56,8.29 14.17,8.9 24.23,8.9 24.59,9.25 34.8,9.25 37.44,11.9 37.44,20.48 v37.14,20.79
RST  (via drill 0.3)
  Top 0.152: R4.1 17.82,31.97 17.37,32.42 v16.66,32.4 16.66,32.42 16.97,32.72 T2.3 16.97,37.51 C6.1 | U$1.GPIO18 7.29,31.12 v7.32,30.95
  Bottom 0.152: v7.32,30.95 8.72,32.35 16.87,32.37 16.9,32.4 v16.66,32.4
RX
  Top 0.152: IC2.1 1.01,33.75 1.47,33.28 8.28,33.28 U$1.URXD
SCL  (via drill 0.3)
  Top 0.152: R2.1 32.07,20.58 33.99,20.58 v34.85,21.45 34.85,22.01 35.41,22.56 35.41,22.97 35.97,23.53 35.97,24.34 36.28,24.65 U1.26 | U$1.GPIO12 7.29,21.67 v10.87,25.26
  Bottom 0.152: v10.87,25.26 11.18,24.95 17.17,24.95 18.34,26.12 30.18,26.12 v34.85,21.45
SDA  (via drill 0.3)
  Top 0.152: R1.1 33.33,21.4 34.44,22.51 v34.59,22.67 35.63,23.71 U1.27 | U$1.NC 13.29,26.7 v14.38,25.61
  Bottom 0.152: v14.38,25.61 17.22,25.61 18.04,26.42 30.84,26.42 v34.59,22.67
TX
  Top 0.152: IC2.5 3.61,33.79 3.81,33.59 9.97,33.59 U$1.UTXD
W  (via drill 0.3)
  Top 0.152: R16.1 23.43,8.34 v24.54,8.34 | v37.64,22.01 39.27,22.01 39.98,21.29 39.98,20.08 40.18,19.87 U1.9
  Bottom 0.152: v24.54,8.34 25.1,8.9 35,8.9 37.85,11.79 37.85,21.6 v37.64,22.01

### Text on the board
Document: - | + | + | WS | 1 | 2 | v1.0 | - | WiFi Yaala / 4W S1D 15